# Altium project 2020Slaveboard_Project.PrjPcb
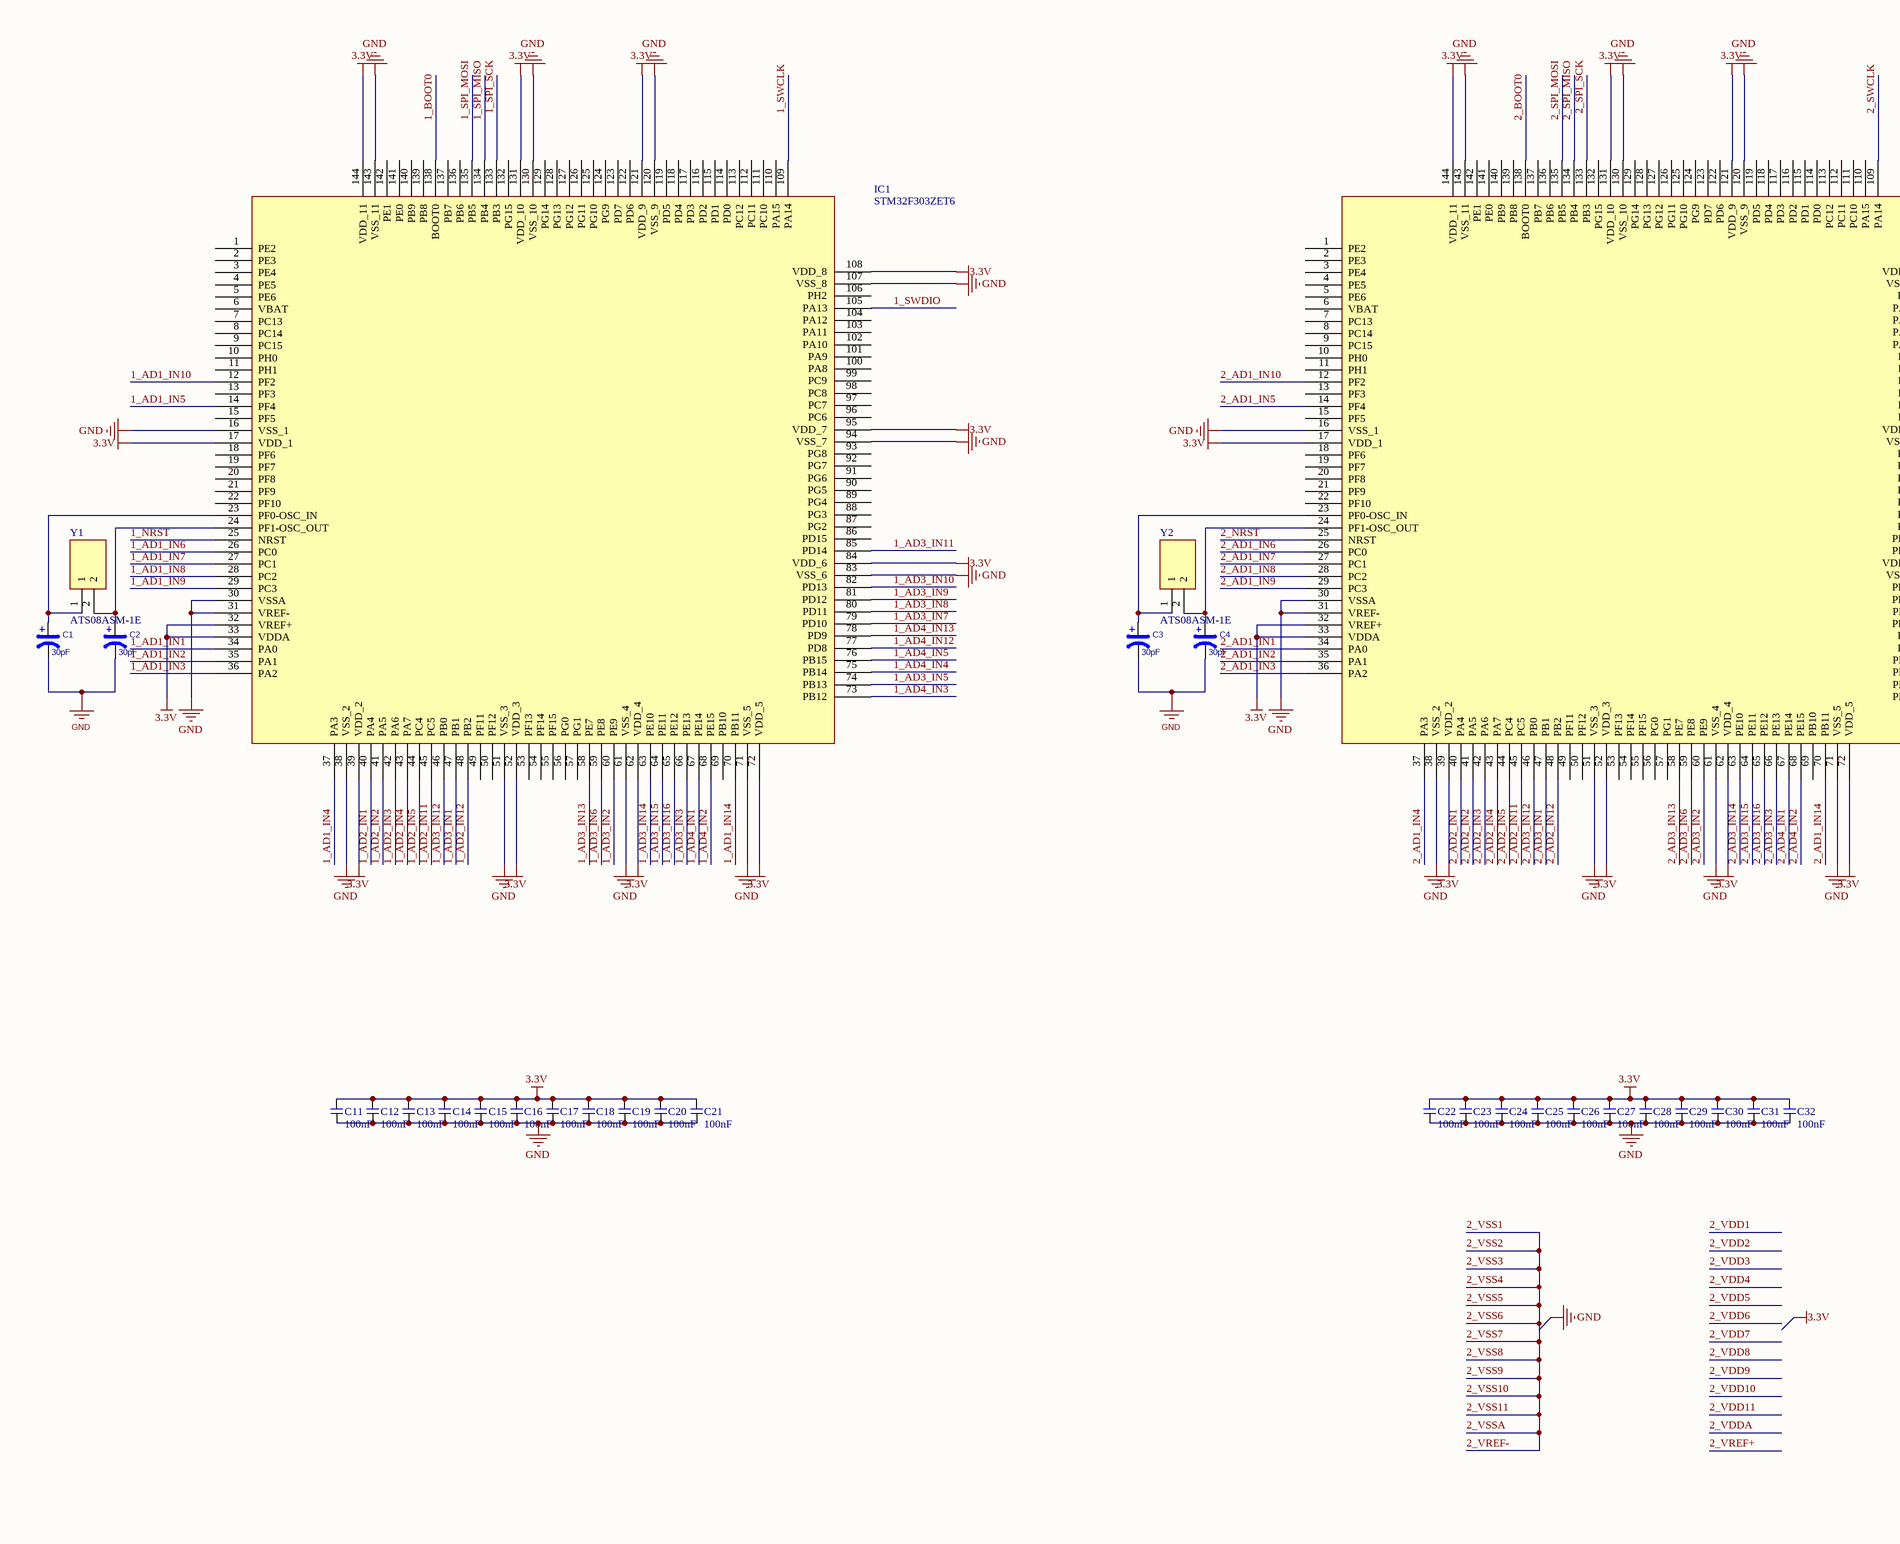
[diagram p0: all_Slaveboard_2020.SchDoc, top left]
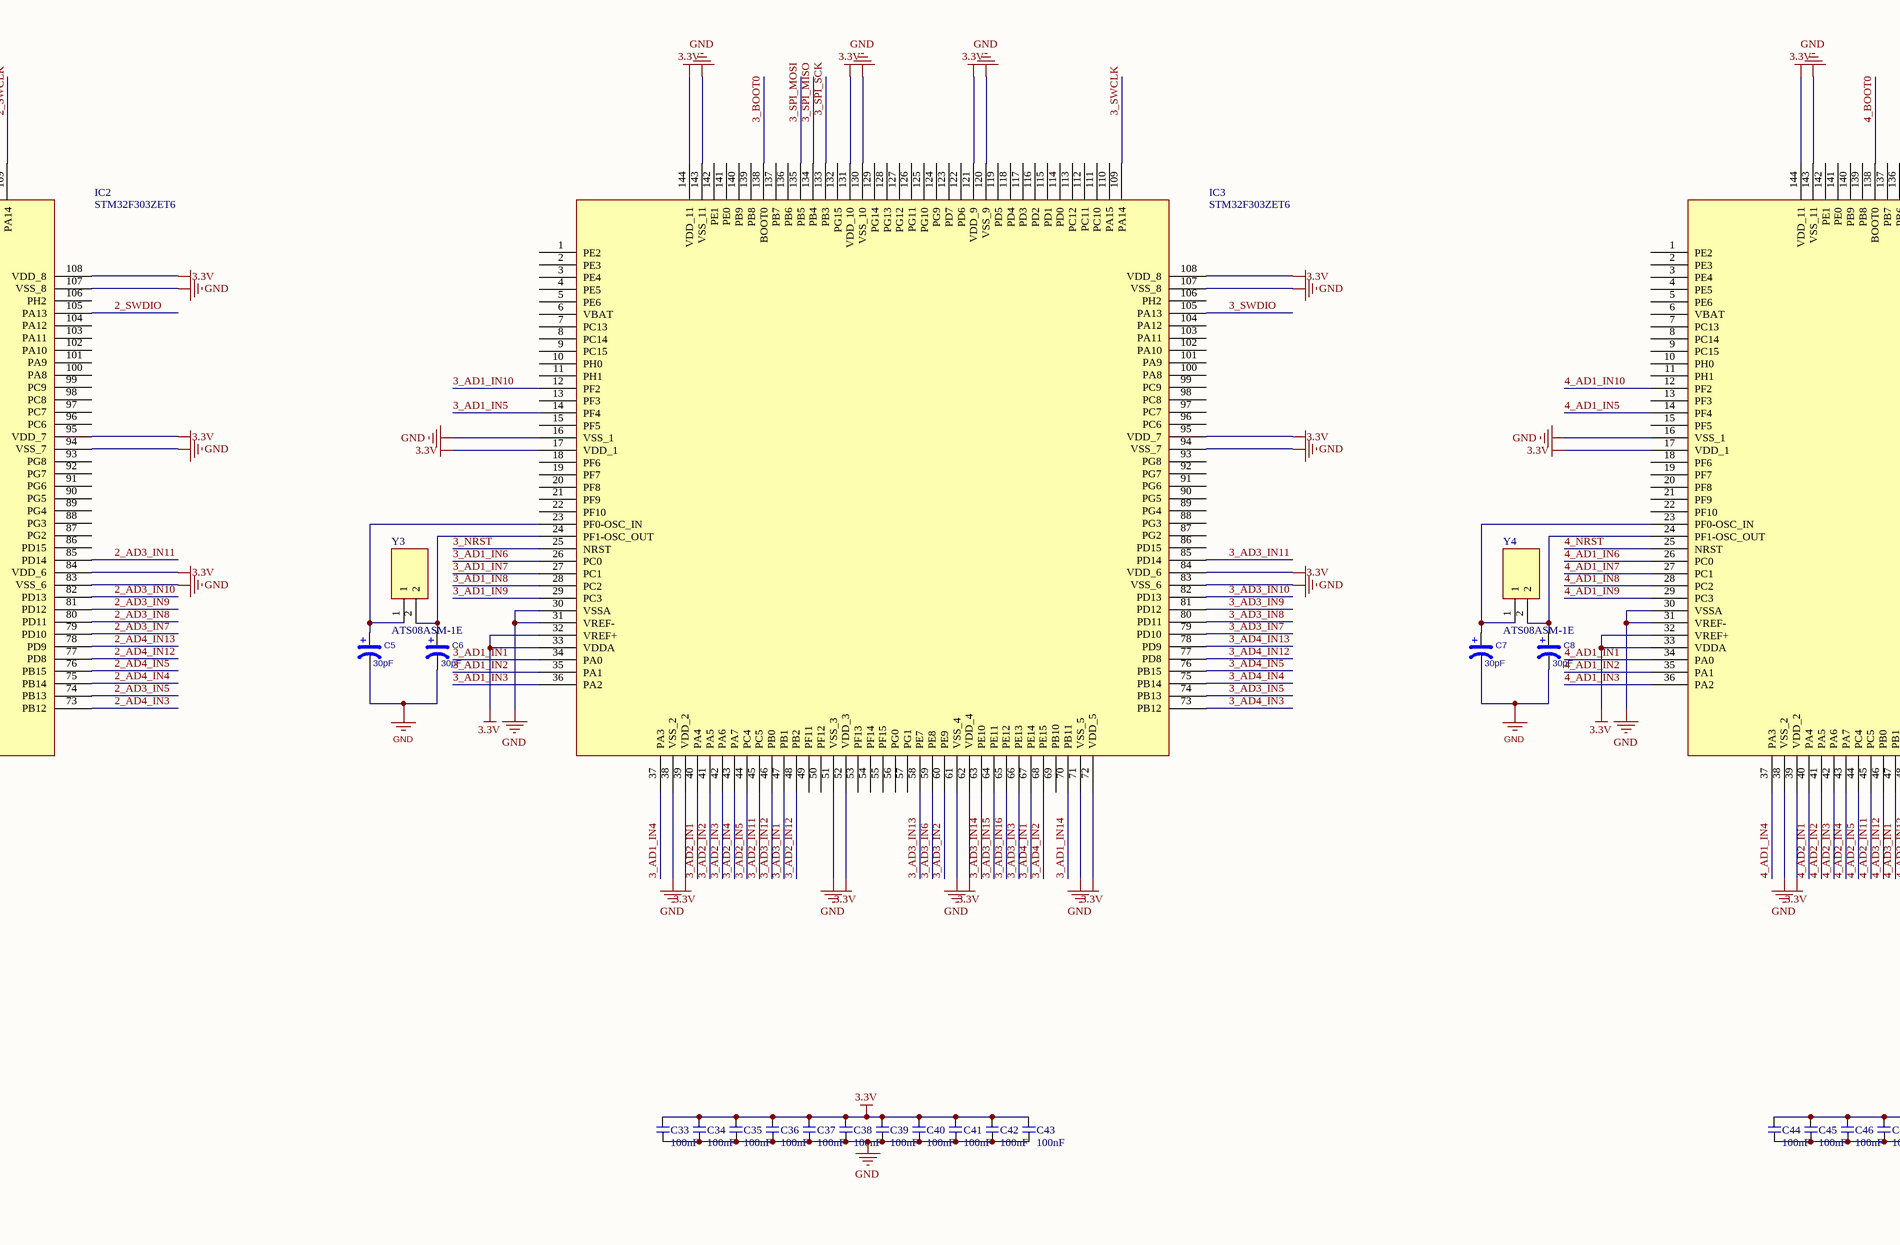
[diagram p1: all_Slaveboard_2020.SchDoc, top middle]
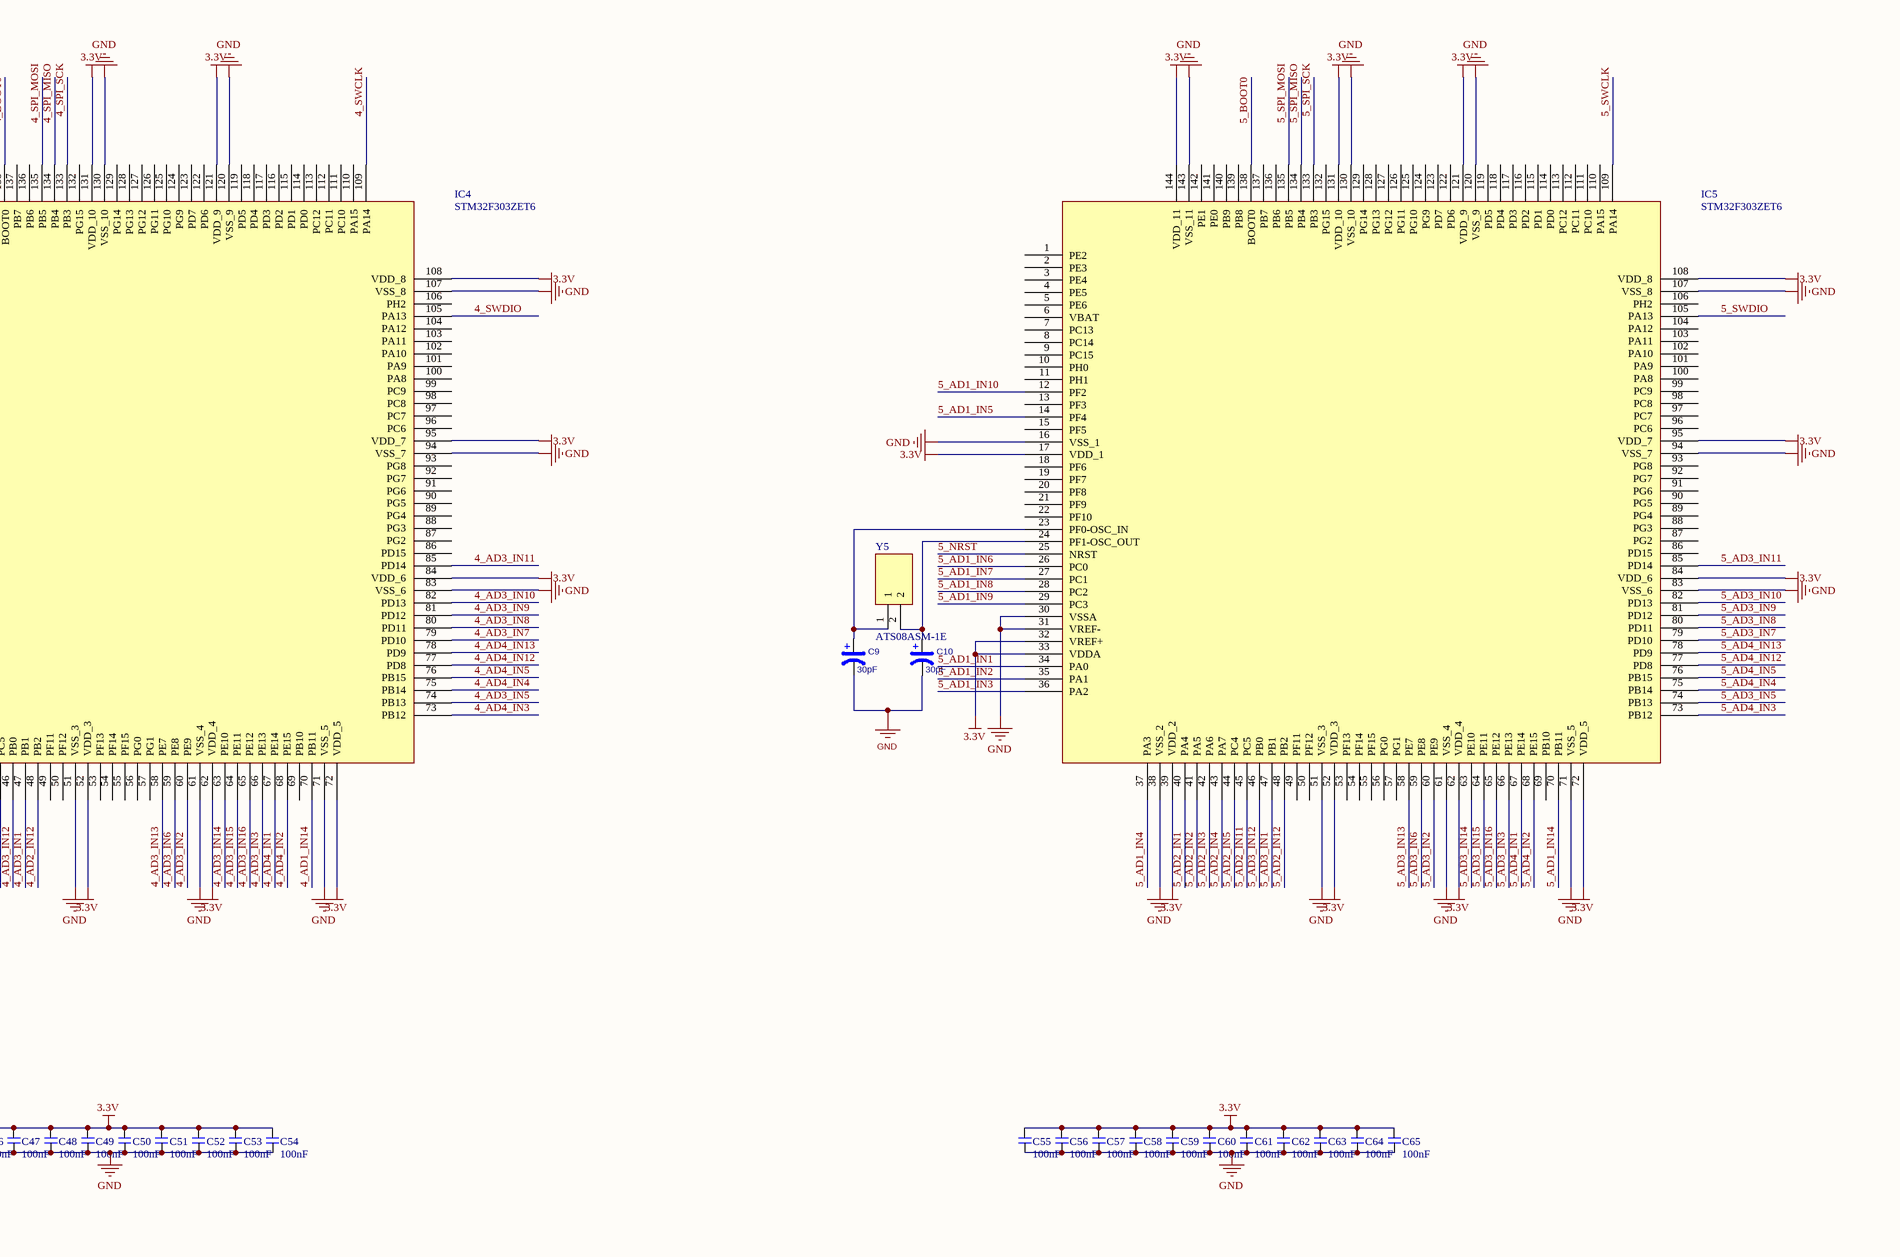
[diagram p2: all_Slaveboard_2020.SchDoc, top right]
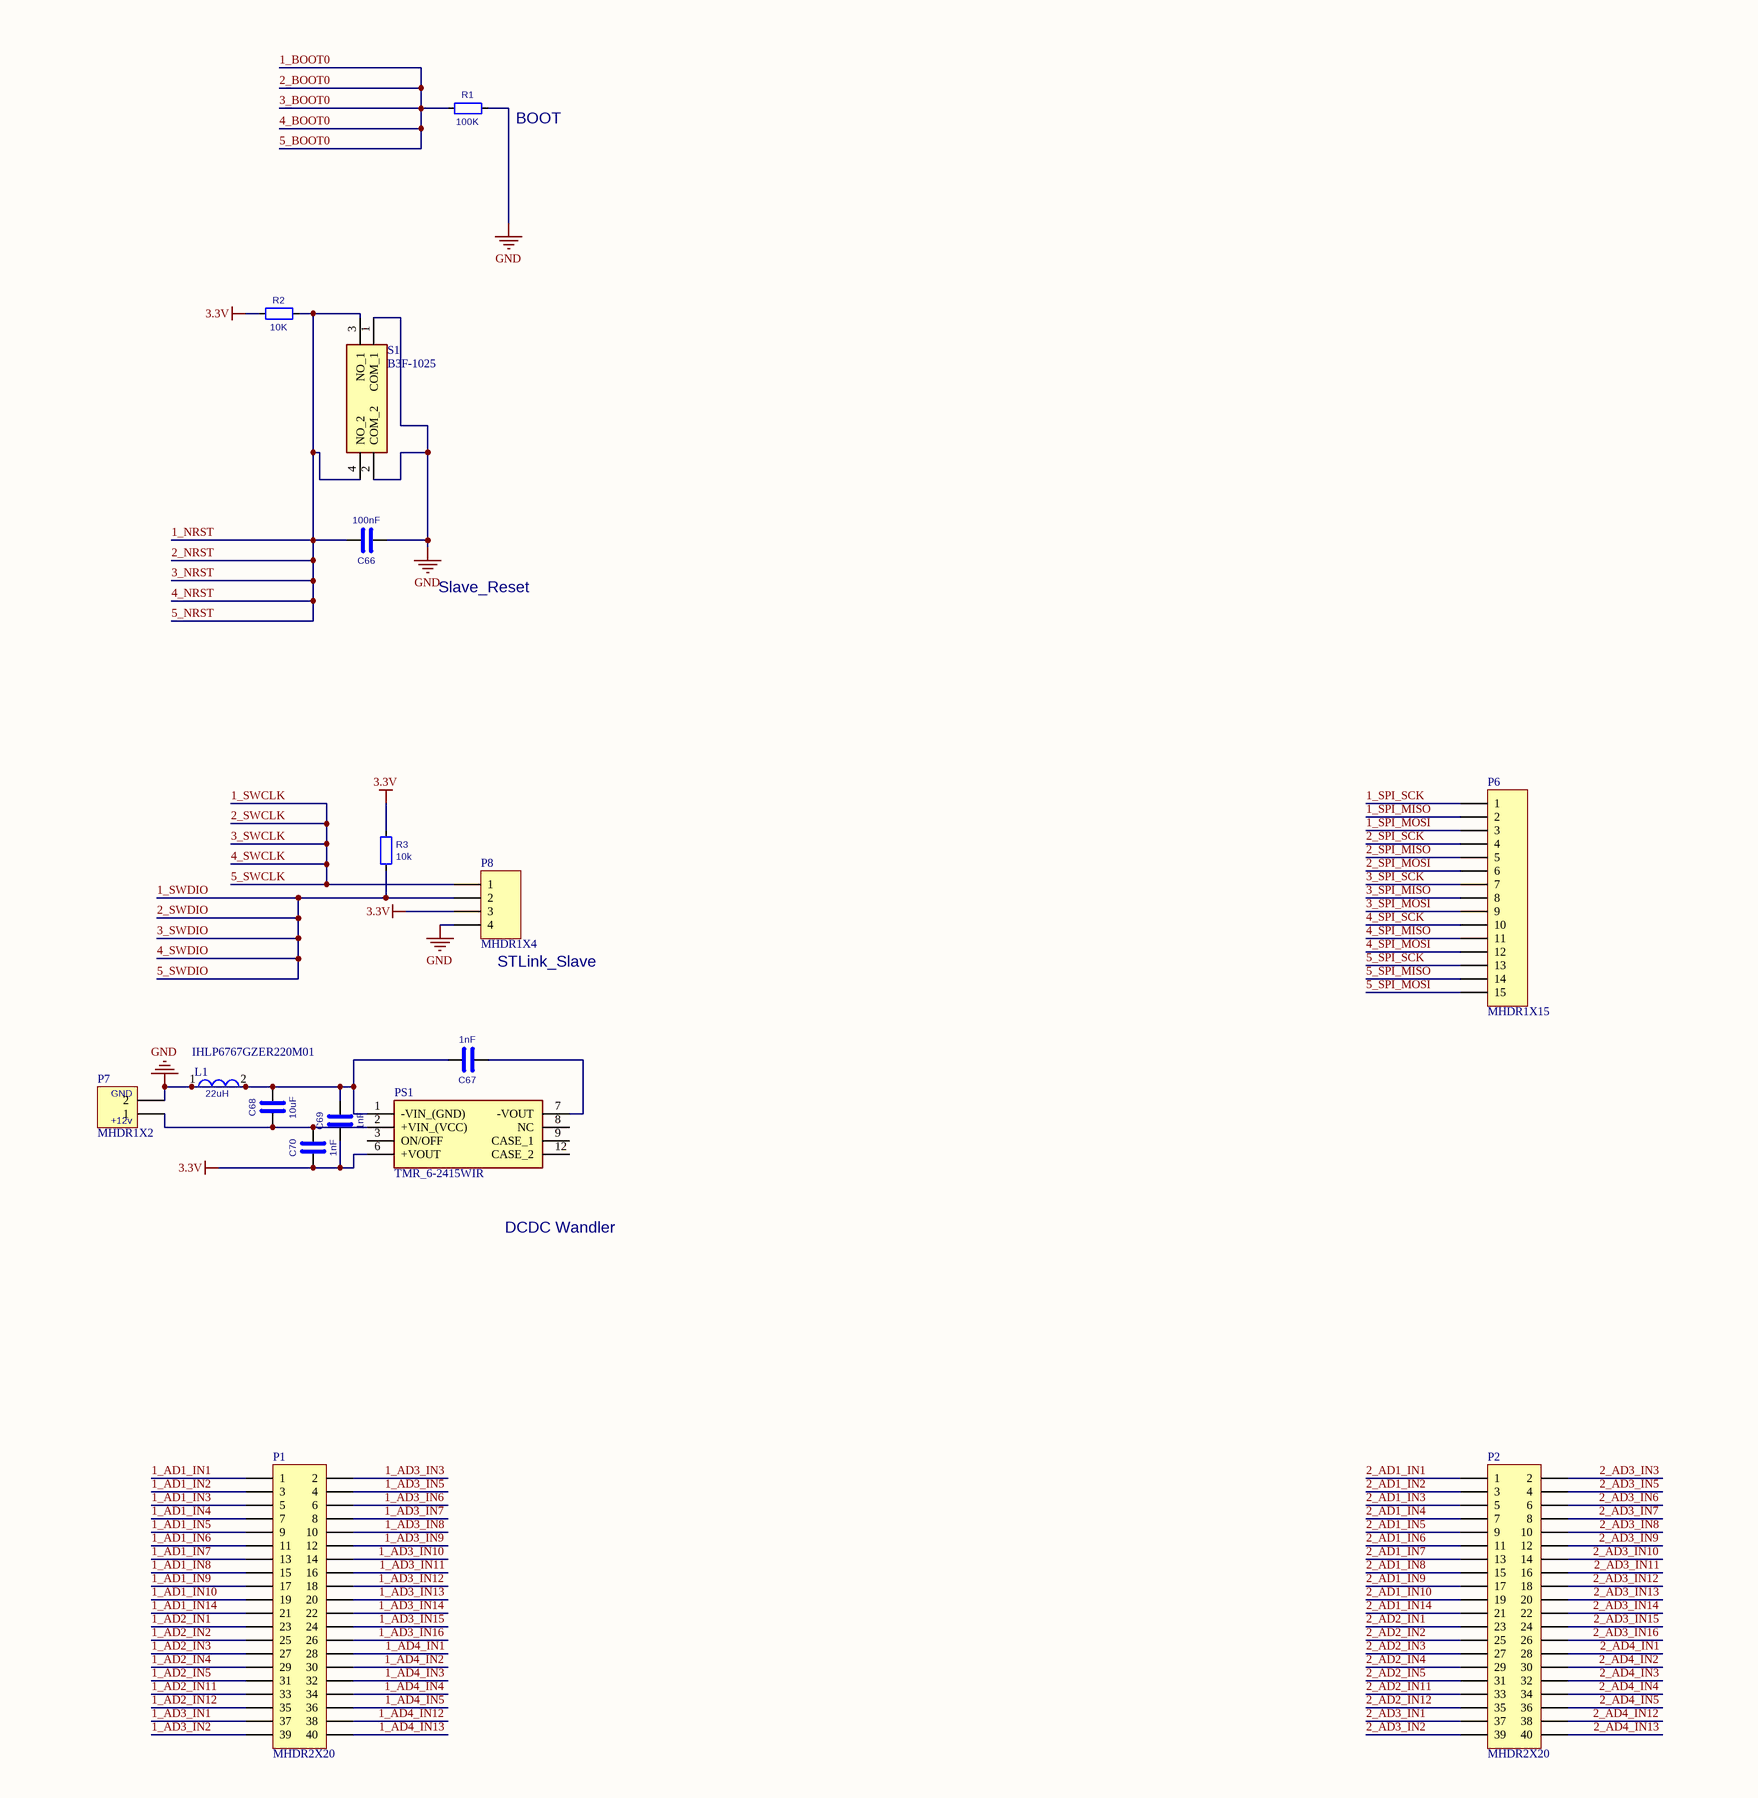
[diagram p3: all_Slaveboard_2020.SchDoc, bottom left]
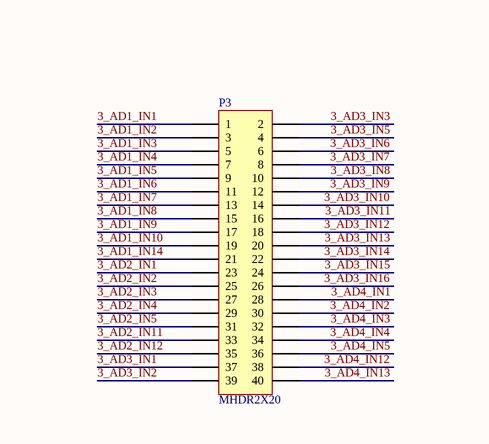
[diagram p4: all_Slaveboard_2020.SchDoc, bottom middle]
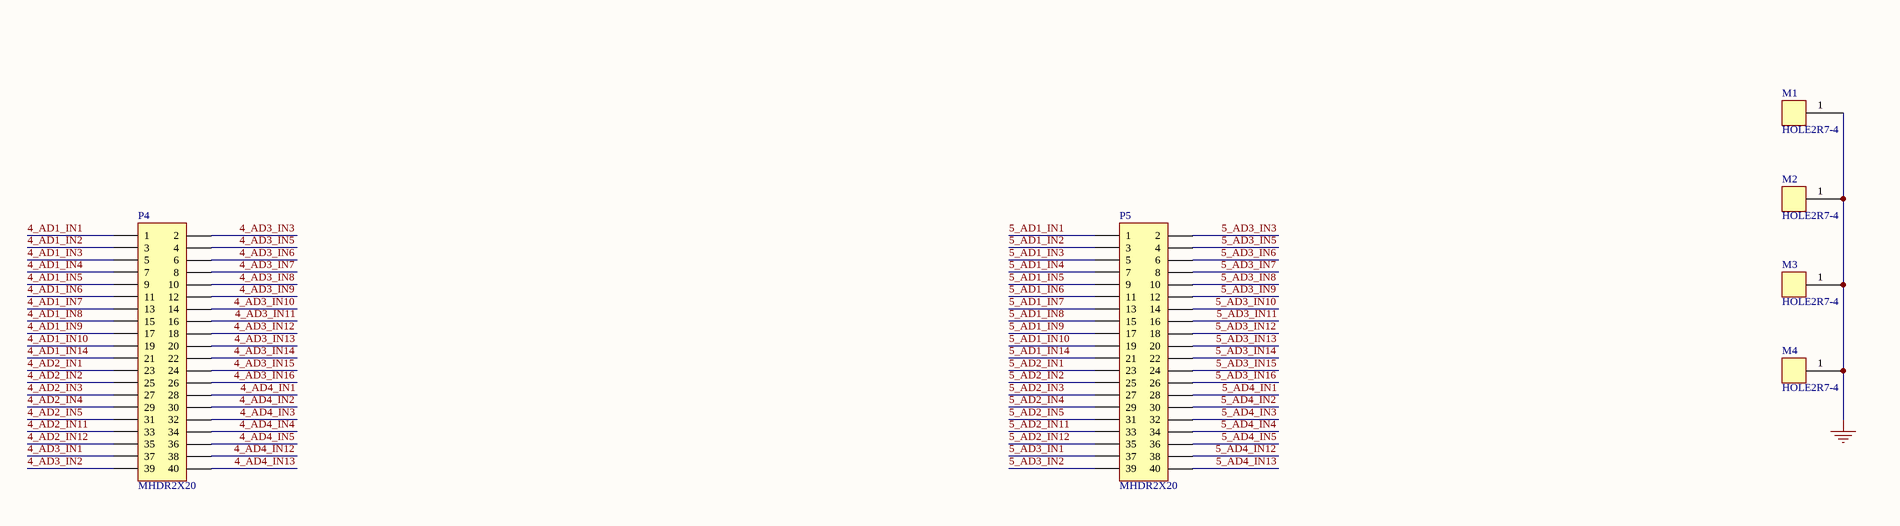
[diagram p5: all_Slaveboard_2020.SchDoc, bottom right]
1 sheet, 98 parts. Net scope: global (net labels, ports and power ports of the same name join across sheets).
Board file: all_Slaveboard_2020.PcbDoc

## Sheet all_Slaveboard_2020.SchDoc
size 1270 x 762 mm; SheetNumber: 1; SheetTotal: 1

### Parts
C1  30pF  [c0805]
C2  30pF  [c0805]
C3  30pF  [c0805]
C4  30pF  [c0805]
C5  30pF  [c0805]
C6  30pF  [c0805]
C7  30pF  [c0805]
C8  30pF  [c0805]
C9  30pF  [c0805]
C10  30pF  [c0805]
C11  100nF  [c0201]
C12  100nF  [c0201]
C13  100nF  [c0201]
C14  100nF  [c0201]
C15  100nF  [c0201]
C16  100nF  [c0201]
C17  100nF  [c0201]
C18  100nF  [c0201]
C19  100nF  [c0201]
C20  100nF  [c0201]
C21  100nF  [c0201]
C22  100nF  [c0201]
C23  100nF  [c0201]
C24  100nF  [c0201]
C25  100nF  [c0201]
C26  100nF  [c0201]
C27  100nF  [c0201]
C28  100nF  [c0201]
C29  100nF  [c0201]
C30  100nF  [c0201]
C31  100nF  [c0201]
C32  100nF  [c0201]
C33  100nF  [c0201]
C34  100nF  [c0201]
C35  100nF  [c0201]
C36  100nF  [c0201]
C37  100nF  [c0201]
C38  100nF  [c0201]
C39  100nF  [c0201]
C40  100nF  [c0201]
C41  100nF  [c0201]
C42  100nF  [c0201]
C43  100nF  [c0201]
C44  100nF  [c0201]
C45  100nF  [c0201]
C46  100nF  [c0201]
C47  100nF  [c0201]
C48  100nF  [c0201]
C49  100nF  [c0201]
C50  100nF  [c0201]
C51  100nF  [c0201]
C52  100nF  [c0201]
C53  100nF  [c0201]
C54  100nF  [c0201]
C55  100nF  [c0201]
C56  100nF  [c0201]
C57  100nF  [c0201]
C58  100nF  [c0201]
C59  100nF  [c0201]
C60  100nF  [c0201]
C61  100nF  [c0201]
C62  100nF  [c0201]
C63  100nF  [c0201]
C64  100nF  [c0201]
C65  100nF  [c0201]
C66  100nF  [c0201]
C67  1nF  [c0201]
C68  value 10uF  [c0201]  (hidden comment: 1nF)
C69  1nF  [c0201]
C70  1nF  [c0201]
IC1  STM32F303ZET6  [f303QFP50P2200X2200X160-144N]
IC2  STM32F303ZET6  [f303QFP50P2200X2200X160-144N]
IC3  STM32F303ZET6  [f303QFP50P2200X2200X160-144N]
IC4  STM32F303ZET6  [f303QFP50P2200X2200X160-144N]
IC5  STM32F303ZET6  [f303QFP50P2200X2200X160-144N]
L1  IHLP6767GZER220M01  [FP-IHLP-6767GZ-FP_3_825x1-MFG]
M1  HOLE2R7-4  [HOLE2R7-4]
M2  HOLE2R7-4  [HOLE2R7-4]
M3  HOLE2R7-4  [HOLE2R7-4]
M4  HOLE2R7-4  [HOLE2R7-4]
P1  MHDR2X20  [MHDR2X20]
P2  MHDR2X20  [MHDR2X20]
P3  MHDR2X20  [MHDR2X20]
P4  MHDR2X20  [MHDR2X20]
P5  MHDR2X20  [MHDR2X20]
P6  MHDR1X15  [MHDR1X15]
P7  MHDR1X2  [MHDR1X2]
P8  MHDR1X4  [MHDR1X4]
PS1  TMR_6-2415WIR  [TMR62410WIR]
R1  value 100K  [C0805]  (hidden comment: 10K)
R2  10K  [C0805]
R3  10k  [C0805]
S1  B3F-1025  [B3F1025]
Y1  ATS08ASM-1E  [ATS040SM1]
Y2  ATS08ASM-1E  [ATS040SM1]
Y3  ATS08ASM-1E  [ATS040SM1]
Y4  ATS08ASM-1E  [ATS040SM1]
Y5  ATS08ASM-1E  [ATS040SM1]

### Nets
3.3V: C11.1 C12.1 C13.1 C14.1 C15.1 C16.1 C17.1 C18.1 C19.1 C20.1 C21.1 C22.1 C23.1 C24.1 C25.1 C26.1 C27.1 C28.1 C29.1 C30.1 C31.1 C32.1 C33.1 C34.1 C35.1 C36.1 C37.1 C38.1 C39.1 C40.1 C41.1 C42.1 C43.1 C44.1 C45.1 C46.1 C47.1 C48.1 C49.1 C50.1 C51.1 C52.1 C53.1 C54.1 C55.1 C56.1 C57.1 C58.1 C59.1 C60.1 C61.1 C62.1 C63.1 C64.1 C65.1 C69.2 C70.2 IC1.17(VDD_1) IC1.32(VREF+) IC1.33(VDDA) IC1.39(VDD_2) IC1.52(VDD_3) IC1.62(VDD_4) IC1.72(VDD_5) IC1.84(VDD_6) IC1.95(VDD_7) IC1.108(VDD_8) IC1.121(VDD_9) IC1.131(VDD_10) IC1.144(VDD_11) IC2.17(VDD_1) IC2.32(VREF+) IC2.33(VDDA) IC2.39(VDD_2) IC2.52(VDD_3) IC2.62(VDD_4) IC2.72(VDD_5) IC2.84(VDD_6) IC2.95(VDD_7) IC2.108(VDD_8) IC2.121(VDD_9) IC2.131(VDD_10) IC2.144(VDD_11) IC3.17(VDD_1) IC3.32(VREF+) IC3.33(VDDA) IC3.39(VDD_2) IC3.52(VDD_3) IC3.62(VDD_4) IC3.72(VDD_5) IC3.84(VDD_6) IC3.95(VDD_7) IC3.108(VDD_8) IC3.121(VDD_9) IC3.131(VDD_10) IC3.144(VDD_11) IC4.17(VDD_1) IC4.32(VREF+) IC4.33(VDDA) IC4.39(VDD_2) IC4.52(VDD_3) IC4.62(VDD_4) IC4.72(VDD_5) IC4.84(VDD_6) IC4.95(VDD_7) IC4.108(VDD_8) IC4.121(VDD_9) IC4.131(VDD_10) IC4.144(VDD_11) IC5.17(VDD_1) IC5.32(VREF+) IC5.33(VDDA) IC5.39(VDD_2) IC5.52(VDD_3) IC5.62(VDD_4) IC5.72(VDD_5) IC5.84(VDD_6) IC5.95(VDD_7) IC5.108(VDD_8) IC5.121(VDD_9) IC5.131(VDD_10) IC5.144(VDD_11) P8.3 PS1.6(+VOUT) R2.2 R3.1
GND: C1.2 C2.2 C3.2 C4.2 C5.2 C6.2 C7.2 C8.2 C9.2 C10.2 C11.2 C12.2 C13.2 C14.2 C15.2 C16.2 C17.2 C18.2 C19.2 C20.2 C21.2 C22.2 C23.2 C24.2 C25.2 C26.2 C27.2 C28.2 C29.2 C30.2 C31.2 C32.2 C33.2 C34.2 C35.2 C36.2 C37.2 C38.2 C39.2 C40.2 C41.2 C42.2 C43.2 C44.2 C45.2 C46.2 C47.2 C48.2 C49.2 C50.2 C51.2 C52.2 C53.2 C54.2 C55.2 C56.2 C57.2 C58.2 C59.2 C60.2 C61.2 C62.2 C63.2 C64.2 C65.2 C66.2 C67.1 C68.1 C69.1 IC1.16(VSS_1) IC1.30(VSSA) IC1.31(VREF-) IC1.38(VSS_2) IC1.51(VSS_3) IC1.61(VSS_4) IC1.71(VSS_5) IC1.83(VSS_6) IC1.94(VSS_7) IC1.107(VSS_8) IC1.120(VSS_9) IC1.130(VSS_10) IC1.143(VSS_11) IC2.16(VSS_1) IC2.30(VSSA) IC2.31(VREF-) IC2.38(VSS_2) IC2.51(VSS_3) IC2.61(VSS_4) IC2.71(VSS_5) IC2.83(VSS_6) IC2.94(VSS_7) IC2.107(VSS_8) IC2.120(VSS_9) IC2.130(VSS_10) IC2.143(VSS_11) IC3.16(VSS_1) IC3.30(VSSA) IC3.31(VREF-) IC3.38(VSS_2) IC3.51(VSS_3) IC3.61(VSS_4) IC3.71(VSS_5) IC3.83(VSS_6) IC3.94(VSS_7) IC3.107(VSS_8) IC3.120(VSS_9) IC3.130(VSS_10) IC3.143(VSS_11) IC4.16(VSS_1) IC4.30(VSSA) IC4.31(VREF-) IC4.38(VSS_2) IC4.51(VSS_3) IC4.61(VSS_4) IC4.71(VSS_5) IC4.83(VSS_6) IC4.94(VSS_7) IC4.107(VSS_8) IC4.120(VSS_9) IC4.130(VSS_10) IC4.143(VSS_11) IC5.16(VSS_1) IC5.30(VSSA) IC5.31(VREF-) IC5.38(VSS_2) IC5.51(VSS_3) IC5.61(VSS_4) IC5.71(VSS_5) IC5.83(VSS_6) IC5.94(VSS_7) IC5.107(VSS_8) IC5.120(VSS_9) IC5.130(VSS_10) IC5.143(VSS_11) L1.1 L1.2 M1.1 M2.1 M3.1 M4.1 P7.2 P8.4 PS1.1(-VIN_(GND)) R1.1 S1.1(COM_1) S1.2(COM_2)
1_AD1_IN1: IC1.34(PA0) P1.1
1_AD1_IN2: IC1.35(PA1) P1.3
1_AD1_IN3: IC1.36(PA2) P1.5
1_AD1_IN4: IC1.37(PA3) P1.7
1_AD1_IN5: IC1.14(PF4) P1.9
1_AD1_IN6: IC1.26(PC0) P1.11
1_AD1_IN7: IC1.27(PC1) P1.13
1_AD1_IN8: IC1.28(PC2) P1.15
1_AD1_IN9: IC1.29(PC3) P1.17
1_AD1_IN10: IC1.12(PF2) P1.19
1_AD1_IN14: IC1.70(PB11) P1.21
1_AD2_IN1: IC1.40(PA4) P1.23
1_AD2_IN2: IC1.41(PA5) P1.25
1_AD2_IN3: IC1.42(PA6) P1.27
1_AD2_IN4: IC1.43(PA7) P1.29
1_AD2_IN5: IC1.44(PC4) P1.31
1_AD2_IN11: IC1.45(PC5) P1.33
1_AD2_IN12: IC1.48(PB2) P1.35
1_AD3_IN1: IC1.47(PB1) P1.37
1_AD3_IN2: IC1.60(PE9) P1.39
1_AD3_IN3: IC1.66(PE13) P1.2
1_AD3_IN5: IC1.74(PB13) P1.4
1_AD3_IN6: IC1.59(PE8) P1.6
1_AD3_IN7: IC1.79(PD10) P1.8
1_AD3_IN8: IC1.80(PD11) P1.10
1_AD3_IN9: IC1.81(PD12) P1.12
1_AD3_IN10: IC1.82(PD13) P1.14
1_AD3_IN11: IC1.85(PD14) P1.16
1_AD3_IN12: IC1.46(PB0) P1.18
1_AD3_IN13: IC1.58(PE7) P1.20
1_AD3_IN14: IC1.63(PE10) P1.22
1_AD3_IN15: IC1.64(PE11) P1.24
1_AD3_IN16: IC1.65(PE12) P1.26
1_AD4_IN1: IC1.67(PE14) P1.28
1_AD4_IN2: IC1.68(PE15) P1.30
1_AD4_IN3: IC1.73(PB12) P1.32
1_AD4_IN4: IC1.75(PB14) P1.34
1_AD4_IN5: IC1.76(PB15) P1.36
1_AD4_IN12: IC1.77(PD8) P1.38
1_AD4_IN13: IC1.78(PD9) P1.40
1_BOOT0: IC1.138(BOOT0) IC2.138(BOOT0) IC3.138(BOOT0) IC4.138(BOOT0) IC5.138(BOOT0) R1.2  [also labelled 2_BOOT0, 3_BOOT0, 4_BOOT0, 5_BOOT0]
1_NRST: C66.1 IC1.25(NRST) IC2.25(NRST) IC3.25(NRST) IC4.25(NRST) IC5.25(NRST) R2.1 S1.3(NO_1) S1.4(NO_2)  [also labelled 2_NRST, 3_NRST, 4_NRST, 5_NRST]
1_SPI_MISO: IC1.134(PB4) P6.2
1_SPI_MOSI: IC1.135(PB5) P6.3
1_SPI_SCK: IC1.133(PB3) P6.1
1_SWCLK: IC1.109(PA14) IC2.109(PA14) IC3.109(PA14) IC4.109(PA14) IC5.109(PA14) P8.1  [also labelled 2_SWCLK, 3_SWCLK, 4_SWCLK, 5_SWCLK]
1_SWDIO: IC1.105(PA13) IC2.105(PA13) IC3.105(PA13) IC4.105(PA13) IC5.105(PA13) P8.2 R3.2  [also labelled 2_SWDIO, 3_SWDIO, 4_SWDIO, 5_SWDIO]
2_AD1_IN1: IC2.34(PA0) P2.1
2_AD1_IN2: IC2.35(PA1) P2.3
2_AD1_IN3: IC2.36(PA2) P2.5
2_AD1_IN4: IC2.37(PA3) P2.7
2_AD1_IN5: IC2.14(PF4) P2.9
2_AD1_IN6: IC2.26(PC0) P2.11
2_AD1_IN7: IC2.27(PC1) P2.13
2_AD1_IN8: IC2.28(PC2) P2.15
2_AD1_IN9: IC2.29(PC3) P2.17
2_AD1_IN10: IC2.12(PF2) P2.19
2_AD1_IN14: IC2.70(PB11) P2.21
2_AD2_IN1: IC2.40(PA4) P2.23
2_AD2_IN2: IC2.41(PA5) P2.25
2_AD2_IN3: IC2.42(PA6) P2.27
2_AD2_IN4: IC2.43(PA7) P2.29
2_AD2_IN5: IC2.44(PC4) P2.31
2_AD2_IN11: IC2.45(PC5) P2.33
2_AD2_IN12: IC2.48(PB2) P2.35
2_AD3_IN1: IC2.47(PB1) P2.37
2_AD3_IN2: IC2.60(PE9) P2.39
2_AD3_IN3: IC2.66(PE13) P2.2
2_AD3_IN5: IC2.74(PB13) P2.4
2_AD3_IN6: IC2.59(PE8) P2.6
2_AD3_IN7: IC2.79(PD10) P2.8
2_AD3_IN8: IC2.80(PD11) P2.10
2_AD3_IN9: IC2.81(PD12) P2.12
2_AD3_IN10: IC2.82(PD13) P2.14
2_AD3_IN11: IC2.85(PD14) P2.16
2_AD3_IN12: IC2.46(PB0) P2.18
2_AD3_IN13: IC2.58(PE7) P2.20
2_AD3_IN14: IC2.63(PE10) P2.22
2_AD3_IN15: IC2.64(PE11) P2.24
2_AD3_IN16: IC2.65(PE12) P2.26
2_AD4_IN1: IC2.67(PE14) P2.28
2_AD4_IN2: IC2.68(PE15) P2.30
2_AD4_IN3: IC2.73(PB12) P2.32
2_AD4_IN4: IC2.75(PB14) P2.34
2_AD4_IN5: IC2.76(PB15) P2.36
2_AD4_IN12: IC2.77(PD8) P2.38
2_AD4_IN13: IC2.78(PD9) P2.40
2_SPI_MISO: IC2.134(PB4) P6.5
2_SPI_MOSI: IC2.135(PB5) P6.6
2_SPI_SCK: IC2.133(PB3) P6.4
3_AD1_IN1: IC3.34(PA0) P3.1
3_AD1_IN2: IC3.35(PA1) P3.3
3_AD1_IN3: IC3.36(PA2) P3.5
3_AD1_IN4: IC3.37(PA3) P3.7
3_AD1_IN5: IC3.14(PF4) P3.9
3_AD1_IN6: IC3.26(PC0) P3.11
3_AD1_IN7: IC3.27(PC1) P3.13
3_AD1_IN8: IC3.28(PC2) P3.15
3_AD1_IN9: IC3.29(PC3) P3.17
3_AD1_IN10: IC3.12(PF2) P3.19
3_AD1_IN14: IC3.70(PB11) P3.21
3_AD2_IN1: IC3.40(PA4) P3.23
3_AD2_IN2: IC3.41(PA5) P3.25
3_AD2_IN3: IC3.42(PA6) P3.27
3_AD2_IN4: IC3.43(PA7) P3.29
3_AD2_IN5: IC3.44(PC4) P3.31
3_AD2_IN11: IC3.45(PC5) P3.33
3_AD2_IN12: IC3.48(PB2) P3.35
3_AD3_IN1: IC3.47(PB1) P3.37
3_AD3_IN2: IC3.60(PE9) P3.39
3_AD3_IN3: IC3.66(PE13) P3.2
3_AD3_IN5: IC3.74(PB13) P3.4
3_AD3_IN6: IC3.59(PE8) P3.6
3_AD3_IN7: IC3.79(PD10) P3.8
3_AD3_IN8: IC3.80(PD11) P3.10
3_AD3_IN9: IC3.81(PD12) P3.12
3_AD3_IN10: IC3.82(PD13) P3.14
3_AD3_IN11: IC3.85(PD14) P3.16
3_AD3_IN12: IC3.46(PB0) P3.18
3_AD3_IN13: IC3.58(PE7) P3.20
3_AD3_IN14: IC3.63(PE10) P3.22
3_AD3_IN15: IC3.64(PE11) P3.24
3_AD3_IN16: IC3.65(PE12) P3.26
3_AD4_IN1: IC3.67(PE14) P3.28
3_AD4_IN2: IC3.68(PE15) P3.30
3_AD4_IN3: IC3.73(PB12) P3.32
3_AD4_IN4: IC3.75(PB14) P3.34
3_AD4_IN5: IC3.76(PB15) P3.36
3_AD4_IN12: IC3.77(PD8) P3.38
3_AD4_IN13: IC3.78(PD9) P3.40
3_SPI_MISO: IC3.134(PB4) P6.8
3_SPI_MOSI: IC3.135(PB5) P6.9
3_SPI_SCK: IC3.133(PB3) P6.7
4_AD1_IN1: IC4.34(PA0) P4.1
4_AD1_IN2: IC4.35(PA1) P4.3
4_AD1_IN3: IC4.36(PA2) P4.5
4_AD1_IN4: IC4.37(PA3) P4.7
4_AD1_IN5: IC4.14(PF4) P4.9
4_AD1_IN6: IC4.26(PC0) P4.11
4_AD1_IN7: IC4.27(PC1) P4.13
4_AD1_IN8: IC4.28(PC2) P4.15
4_AD1_IN9: IC4.29(PC3) P4.17
4_AD1_IN10: IC4.12(PF2) P4.19
4_AD1_IN14: IC4.70(PB11) P4.21
4_AD2_IN1: IC4.40(PA4) P4.23
4_AD2_IN2: IC4.41(PA5) P4.25
4_AD2_IN3: IC4.42(PA6) P4.27
4_AD2_IN4: IC4.43(PA7) P4.29
4_AD2_IN5: IC4.44(PC4) P4.31
4_AD2_IN11: IC4.45(PC5) P4.33
4_AD2_IN12: IC4.48(PB2) P4.35
4_AD3_IN1: IC4.47(PB1) P4.37
4_AD3_IN2: IC4.60(PE9) P4.39
4_AD3_IN3: IC4.66(PE13) P4.2
4_AD3_IN5: IC4.74(PB13) P4.4
4_AD3_IN6: IC4.59(PE8) P4.6
4_AD3_IN7: IC4.79(PD10) P4.8
4_AD3_IN8: IC4.80(PD11) P4.10
4_AD3_IN9: IC4.81(PD12) P4.12
4_AD3_IN10: IC4.82(PD13) P4.14
4_AD3_IN11: IC4.85(PD14) P4.16
4_AD3_IN12: IC4.46(PB0) P4.18
4_AD3_IN13: IC4.58(PE7) P4.20
4_AD3_IN14: IC4.63(PE10) P4.22
4_AD3_IN15: IC4.64(PE11) P4.24
4_AD3_IN16: IC4.65(PE12) P4.26
4_AD4_IN1: IC4.67(PE14) P4.28
4_AD4_IN2: IC4.68(PE15) P4.30
4_AD4_IN3: IC4.73(PB12) P4.32
4_AD4_IN4: IC4.75(PB14) P4.34
4_AD4_IN5: IC4.76(PB15) P4.36
4_AD4_IN12: IC4.77(PD8) P4.38
4_AD4_IN13: IC4.78(PD9) P4.40
4_SPI_MISO: IC4.134(PB4) P6.11
4_SPI_MOSI: IC4.135(PB5) P6.12
4_SPI_SCK: IC4.133(PB3) P6.10
5_AD1_IN1: IC5.34(PA0) P5.1
5_AD1_IN2: IC5.35(PA1) P5.3
5_AD1_IN3: IC5.36(PA2) P5.5
5_AD1_IN4: IC5.37(PA3) P5.7
5_AD1_IN5: IC5.14(PF4) P5.9
5_AD1_IN6: IC5.26(PC0) P5.11
5_AD1_IN7: IC5.27(PC1) P5.13
5_AD1_IN8: IC5.28(PC2) P5.15
5_AD1_IN9: IC5.29(PC3) P5.17
5_AD1_IN10: IC5.12(PF2) P5.19
5_AD1_IN14: IC5.70(PB11) P5.21
5_AD2_IN1: IC5.40(PA4) P5.23
5_AD2_IN2: IC5.41(PA5) P5.25
5_AD2_IN3: IC5.42(PA6) P5.27
5_AD2_IN4: IC5.43(PA7) P5.29
5_AD2_IN5: IC5.44(PC4) P5.31
5_AD2_IN11: IC5.45(PC5) P5.33
5_AD2_IN12: IC5.48(PB2) P5.35
5_AD3_IN1: IC5.47(PB1) P5.37
5_AD3_IN2: IC5.60(PE9) P5.39
5_AD3_IN3: IC5.66(PE13) P5.2
5_AD3_IN5: IC5.74(PB13) P5.4
5_AD3_IN6: IC5.59(PE8) P5.6
5_AD3_IN7: IC5.79(PD10) P5.8
5_AD3_IN8: IC5.80(PD11) P5.10
5_AD3_IN9: IC5.81(PD12) P5.12
5_AD3_IN10: IC5.82(PD13) P5.14
5_AD3_IN11: IC5.85(PD14) P5.16
5_AD3_IN12: IC5.46(PB0) P5.18
5_AD3_IN13: IC5.58(PE7) P5.20
5_AD3_IN14: IC5.63(PE10) P5.22
5_AD3_IN15: IC5.64(PE11) P5.24
5_AD3_IN16: IC5.65(PE12) P5.26
5_AD4_IN1: IC5.67(PE14) P5.28
5_AD4_IN2: IC5.68(PE15) P5.30
5_AD4_IN3: IC5.73(PB12) P5.32
5_AD4_IN4: IC5.75(PB14) P5.34
5_AD4_IN5: IC5.76(PB15) P5.36
5_AD4_IN12: IC5.77(PD8) P5.38
5_AD4_IN13: IC5.78(PD9) P5.40
5_SPI_MISO: IC5.134(PB4) P6.14
5_SPI_MOSI: IC5.135(PB5) P6.15
5_SPI_SCK: IC5.133(PB3) P6.13
NetC1_1: C1.1 IC1.23(PF0-OSC_IN) Y1.1
NetC2_1: C2.1 IC1.24(PF1-OSC_OUT) Y1.2
NetC3_1: C3.1 IC2.23(PF0-OSC_IN) Y2.1
NetC4_1: C4.1 IC2.24(PF1-OSC_OUT) Y2.2
NetC5_1: C5.1 IC3.23(PF0-OSC_IN) Y3.1
NetC6_1: C6.1 IC3.24(PF1-OSC_OUT) Y3.2
NetC7_1: C7.1 IC4.23(PF0-OSC_IN) Y4.1
NetC8_1: C8.1 IC4.24(PF1-OSC_OUT) Y4.2
NetC9_1: C9.1 IC5.23(PF0-OSC_IN) Y5.1
NetC10_1: C10.1 IC5.24(PF1-OSC_OUT) Y5.2
NetC67_2: C67.2 PS1.7(-VOUT)
NetC68_2: C68.2 C70.1 P7.1 PS1.2(+VIN_(VCC))

Not connected (* = marked no-connect by the designer): IC1 1(PE2) 2(PE3) 3(PE4) 4(PE5) 5(PE6) 6(VBAT) 7(PC13) 8(PC14) 9(PC15) 10(PH0) 11(PH1) 13(PF3) 15(PF5) 18(PF6) 19(PF7) 20(PF8) 21(PF9) 22(PF10) 49(PF11) 50(PF12) 53(PF13) 54(PF14) 55(PF15) 56(PG0) 57(PG1) 69(PB10) 86(PD15) 87(PG2) 88(PG3) 89(PG4) 90(PG5) 91(PG6) 92(PG7) 93(PG8) 96(PC6) 97(PC7) 98(PC8) 99(PC9) 100(PA8) 101(PA9) 102(PA10) 103(PA11) 104(PA12) 106(PH2) 110(PA15) 111(PC10) 112(PC11) 113(PC12) 114(PD0) 115(PD1) 116(PD2) 117(PD3) 118(PD4) 119(PD5) 122(PD6) 123(PD7) 124(PG9) 125(PG10) 126(PG11) 127(PG12) 128(PG13) 129(PG14) 132(PG15) 136(PB6) 137(PB7) 139(PB8) 140(PB9) 141(PE0) 142(PE1); IC2 1(PE2) 2(PE3) 3(PE4) 4(PE5) 5(PE6) 6(VBAT) 7(PC13) 8(PC14) 9(PC15) 10(PH0) 11(PH1) 13(PF3) 15(PF5) 18(PF6) 19(PF7) 20(PF8) 21(PF9) 22(PF10) 49(PF11) 50(PF12) 53(PF13) 54(PF14) 55(PF15) 56(PG0) 57(PG1) 69(PB10) 86(PD15) 87(PG2) 88(PG3) 89(PG4) 90(PG5) 91(PG6) 92(PG7) 93(PG8) 96(PC6) 97(PC7) 98(PC8) 99(PC9) 100(PA8) 101(PA9) 102(PA10) 103(PA11) 104(PA12) 106(PH2) 110(PA15) 111(PC10) 112(PC11) 113(PC12) 114(PD0) 115(PD1) 116(PD2) 117(PD3) 118(PD4) 119(PD5) 122(PD6) 123(PD7) 124(PG9) 125(PG10) 126(PG11) 127(PG12) 128(PG13) 129(PG14) 132(PG15) 136(PB6) 137(PB7) 139(PB8) 140(PB9) 141(PE0) 142(PE1); IC3 1(PE2) 2(PE3) 3(PE4) 4(PE5) 5(PE6) 6(VBAT) 7(PC13) 8(PC14) 9(PC15) 10(PH0) 11(PH1) 13(PF3) 15(PF5) 18(PF6) 19(PF7) 20(PF8) 21(PF9) 22(PF10) 49(PF11) 50(PF12) 53(PF13) 54(PF14) 55(PF15) 56(PG0) 57(PG1) 69(PB10) 86(PD15) 87(PG2) 88(PG3) 89(PG4) 90(PG5) 91(PG6) 92(PG7) 93(PG8) 96(PC6) 97(PC7) 98(PC8) 99(PC9) 100(PA8) 101(PA9) 102(PA10) 103(PA11) 104(PA12) 106(PH2) 110(PA15) 111(PC10) 112(PC11) 113(PC12) 114(PD0) 115(PD1) 116(PD2) 117(PD3) 118(PD4) 119(PD5) 122(PD6) 123(PD7) 124(PG9) 125(PG10) 126(PG11) 127(PG12) 128(PG13) 129(PG14) 132(PG15) 136(PB6) 137(PB7) 139(PB8) 140(PB9) 141(PE0) 142(PE1); IC4 1(PE2) 2(PE3) 3(PE4) 4(PE5) 5(PE6) 6(VBAT) 7(PC13) 8(PC14) 9(PC15) 10(PH0) 11(PH1) 13(PF3) 15(PF5) 18(PF6) 19(PF7) 20(PF8) 21(PF9) 22(PF10) 49(PF11) 50(PF12) 53(PF13) 54(PF14) 55(PF15) 56(PG0) 57(PG1) 69(PB10) 86(PD15) 87(PG2) 88(PG3) 89(PG4) 90(PG5) 91(PG6) 92(PG7) 93(PG8) 96(PC6) 97(PC7) 98(PC8) 99(PC9) 100(PA8) 101(PA9) 102(PA10) 103(PA11) 104(PA12) 106(PH2) 110(PA15) 111(PC10) 112(PC11) 113(PC12) 114(PD0) 115(PD1) 116(PD2) 117(PD3) 118(PD4) 119(PD5) 122(PD6) 123(PD7) 124(PG9) 125(PG10) 126(PG11) 127(PG12) 128(PG13) 129(PG14) 132(PG15) 136(PB6) 137(PB7) 139(PB8) 140(PB9) 141(PE0) 142(PE1); IC5 1(PE2) 2(PE3) 3(PE4) 4(PE5) 5(PE6) 6(VBAT) 7(PC13) 8(PC14) 9(PC15) 10(PH0) 11(PH1) 13(PF3) 15(PF5) 18(PF6) 19(PF7) 20(PF8) 21(PF9) 22(PF10) 49(PF11) 50(PF12) 53(PF13) 54(PF14) 55(PF15) 56(PG0) 57(PG1) 69(PB10) 86(PD15) 87(PG2) 88(PG3) 89(PG4) 90(PG5) 91(PG6) 92(PG7) 93(PG8) 96(PC6) 97(PC7) 98(PC8) 99(PC9) 100(PA8) 101(PA9) 102(PA10) 103(PA11) 104(PA12) 106(PH2) 110(PA15) 111(PC10) 112(PC11) 113(PC12) 114(PD0) 115(PD1) 116(PD2) 117(PD3) 118(PD4) 119(PD5) 122(PD6) 123(PD7) 124(PG9) 125(PG10) 126(PG11) 127(PG12) 128(PG13) 129(PG14) 132(PG15) 136(PB6) 137(PB7) 139(PB8) 140(PB9) 141(PE0) 142(PE1); PS1 3(ON/OFF) 8(NC) 9(CASE_1) 12(CASE_2)

### Notes on the sheet
- (near R1) BOOT
- Slave_Reset
- (near P8) STLink_Slave
- (near P7) GND
- (near L1) 22uH
- (near P7) +12v
- DCDC Wandler
- Labels drawn without touching a wire or pin: 3.3V, GND

### Library data of the parts
C1-C10 = CP1: Value: 30pF
C11-C65 = Cap_0805
C66-C70 = C
  C66: Value: 100nF
  C67 C69 C70: Value: 1nF
L1 = CMP-02424-000149-1: Commercial Inductors, High Saturation Series 22uH 11A 26.5mΩ 20%; Core Material: Metal; Shielding: Shielded; Saturation Current: 23A; Self Resonant Frequency: 2MHz; Test Frequency: 100kHz; DC Resistance (DCR): 26.5mR; RMS Current (Irms): 11A; Depth: 17.15mm; Min Operating Temperature: -55°C; Tolerance: 20%; Length: 17.15mm; Lead Free: Lead Free; Max DC Current: 23A; Package Quantity: 200; Height - Seated (Max): 0.157inch; Mount: Surface Mount; Packaging: Tape and Reel; Inductance: 22uH; Case/Package: 6767; Military Standard: Not; Max Operating Temperature: 125°C; Termination: SMD/SMT; Current Rating: 11A; Radiation Hardening: No; Width: 0.675inch; Inductance Tolerance: 20%; Height: 7mm
P1-P5 = MHDR2X20: Header, 20-Pin, Dual row; LatestRevisionDate: 17-Jul-2002; LatestRevisionNote: Re-released for DXP Platform.; Publisher: Altium Limited
P6 = MHDR1X15: Header, 15-Pin; LatestRevisionDate: 17-Jul-2002; LatestRevisionNote: Re-released for DXP Platform.; Publisher: Altium Limited
P7 = MHDR1X2: Header, 2-Pin; LatestRevisionDate: 17-Jul-2002; LatestRevisionNote: Re-released for DXP Platform.; Publisher: Altium Limited
P8 = MHDR1X4: Header, 4-Pin; LatestRevisionDate: 17-Jul-2002; LatestRevisionNote: Re-released for DXP Platform.; Publisher: Altium Limited
PS1 = TMR_6-2415WIR: Power Supply; Manufacturer_Name: Traco Power; Manufacturer_Part_Number: TMR 6-2415WIR; Datasheet Link: https://componentsearchengine.com/Datasheets/2/TMR 6-2415WIR.pdf; Height: 11.7mm; Mouser Part Number: 495-TMR6-2415WIR; Mouser Price/Stock: https://www.mouser.co.uk/ProductDetail/TRACO-Power/TMR-6-2415WIR?qs=y6ZabgHbY%252ByrRGfp%2FzTT2Q%3D%3D
R1-R3 = R
  R2: Value: 10K
  R3: Value: 10k
S1 = B3F-1025: Switch; Manufacturer_Name: Omron Electronics; Datasheet Link: http://uk.rs-online.com/web/p/products/6821140; Height: 5.2mm; Manufacturer_Part_Number: B3F-1025; Mouser Part Number: 653-B3F-1025; Mouser Price/Stock: https://www.mouser.co.uk/ProductDetail/Omron-Electronics/B3F-1025?qs=1tDaWCEHQQ7ZoQQuZXPfLw%3D%3D
Y1-Y5 = ATS08ASM-1E: Crystal or Oscillator; Manufacturer_Name: CTS; Datasheet Link: https://www.ctscorp.com/wp-content/uploads/ATS-ATSSM.pdf; Height: 4.3mm; Manufacturer_Part_Number: ATS08ASM-1E; Arrow Part Number: ATS08ASM-1E; Arrow Price/Stock: https://www.arrow.com/en/products/ats08asm-1e/cts; Mouser Part Number: 774-ATS08ASM-1E; Mouser Price/Stock: https://www.mouser.co.uk/ProductDetail/CTS-Electronic-Components/ATS08ASM-1E/?qs=tjlMjqRIEYSoOC%2FyJ4%2Frjw%3D%3D